# Altium schematic sheet ETH.SchDoc
size C; SheetNumber: 7; SheetTotal: 9
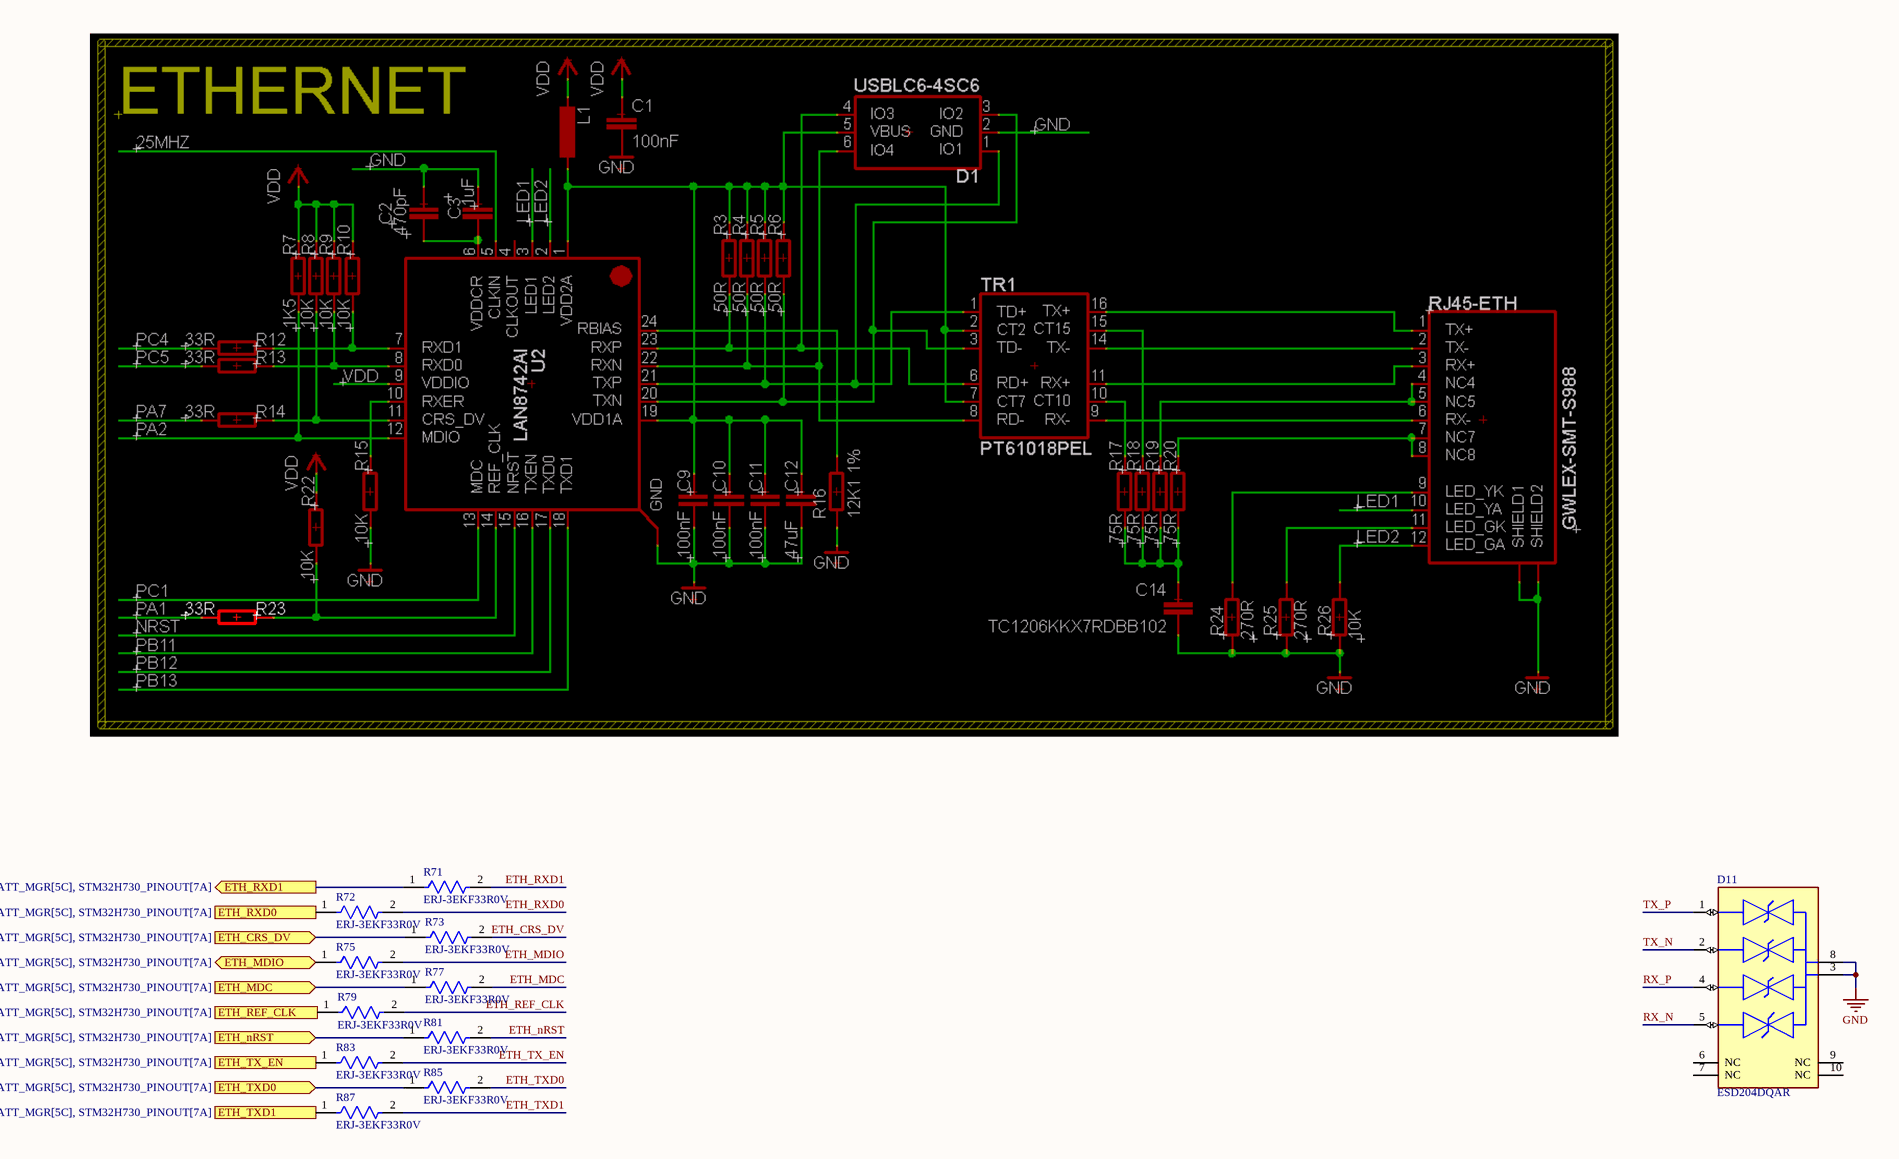
[diagram p0: ETH.SchDoc, top left]
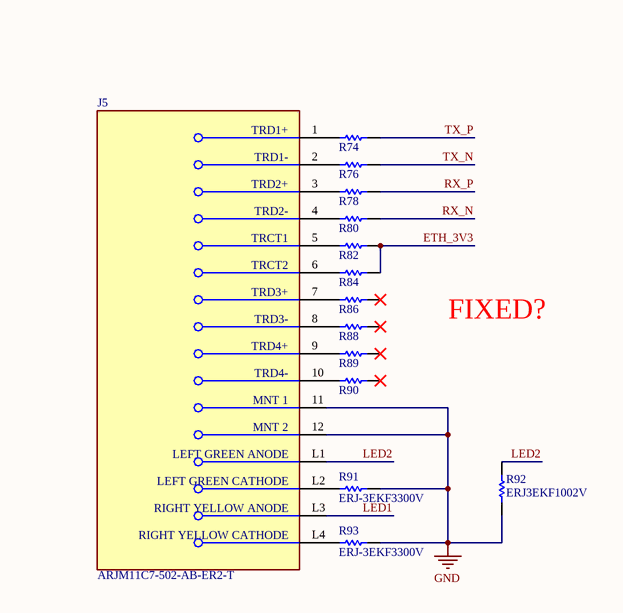
[diagram p1: ETH.SchDoc, top right]
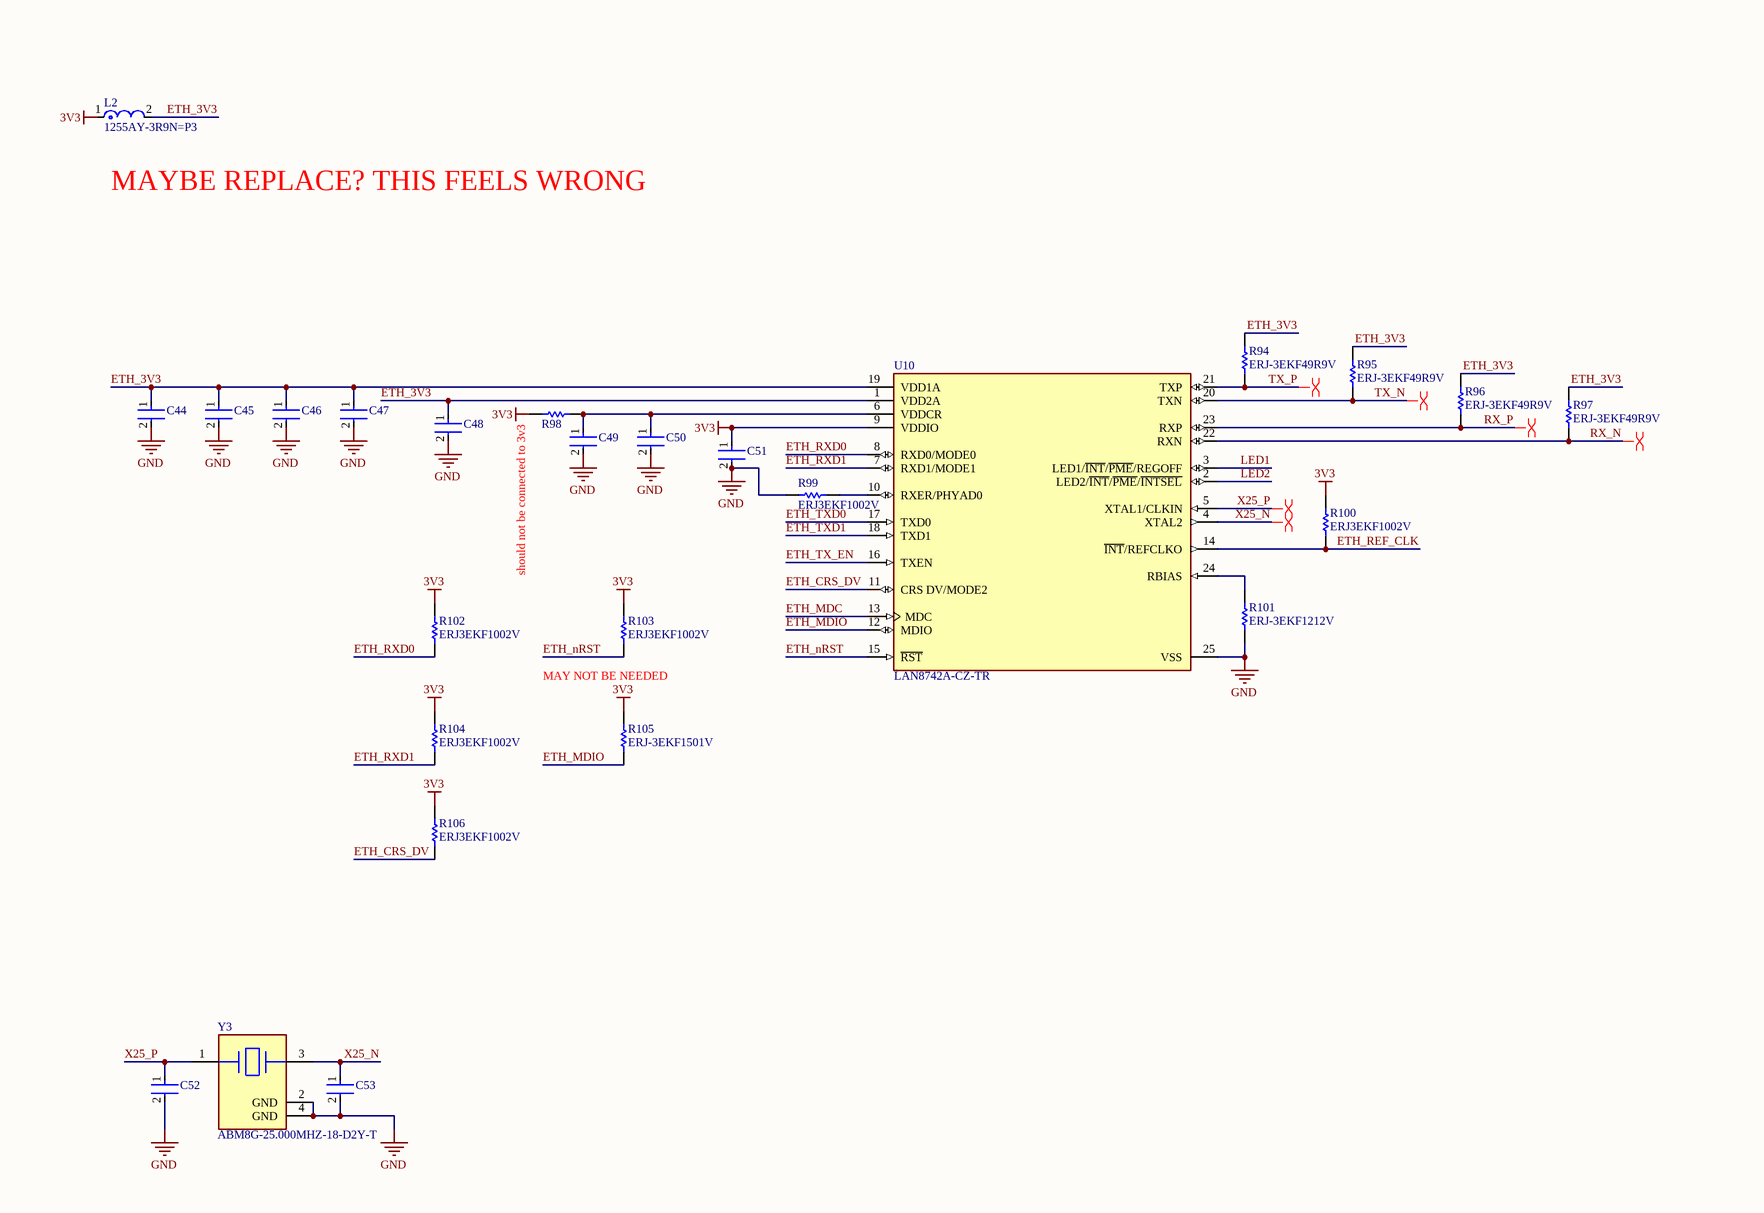
[diagram p2: ETH.SchDoc, bottom left]

## Parts
C44  DNO - C0805C476M9PACTU  [FP-C0805C476M9PACTU-MFG]  (value not drawn)
C45  100n  [FP-0402-L_1_0_0_05-W_0_5-IPC_A]  (value not drawn)
C46  100n  [FP-0402-L_1_0_0_05-W_0_5-IPC_A]  (value not drawn)
C47  100n  [FP-0402-L_1_0_0_05-W_0_5-IPC_A]  (value not drawn)
C48  100n  [FP-0402-L_1_0_0_05-W_0_5-IPC_A]  (value not drawn)
C49  1u  [FP-0402-L_1_0_0_05-W_0_5-IPC_A]  (value not drawn)
C50  470p  [FP-0402-L_1_0_0_05-W_0_5-IPC_A]  (value not drawn)
C51  100n  [FP-0402-L_1_0_0_05-W_0_5-IPC_A]  (value not drawn)
C52  C0603C300J5GACTU  [FP-C0603C-CF-MFG]  (value not drawn)
C53  C0603C300J5GACTU  [FP-C0603C-CF-MFG]  (value not drawn)
D11  ESD204DQAR  [FP-DQA0010A-MFG]
J5  ARJM11C7-502-AB-ER2-T  [FP-ARJM11C7-502-AB-ER2-T-MFG]
L2  1255AY-3R9N=P3  [FP-DG6045C-MFG]
R71  ERJ-3EKF33R0V  [FP-ERJ3EK-MFG]
R72  ERJ-3EKF33R0V  [FP-ERJ3EK-MFG]
R73  ERJ-3EKF33R0V  [FP-ERJ3EK-MFG]
R74  0402 JUMPER 0 OHM  [RESC1005X40X25NL05T05]  (value not drawn)
R75  ERJ-3EKF33R0V  [FP-ERJ3EK-MFG]
R76  0402 JUMPER 0 OHM  [RESC1005X40X25NL05T05]  (value not drawn)
R77  ERJ-3EKF33R0V  [FP-ERJ3EK-MFG]
R78  0402 JUMPER 0 OHM  [RESC1005X40X25NL05T05]  (value not drawn)
R79  ERJ-3EKF33R0V  [FP-ERJ3EK-MFG]
R80  0402 JUMPER 0 OHM  [RESC1005X40X25NL05T05]  (value not drawn)
R81  ERJ-3EKF33R0V  [FP-ERJ3EK-MFG]
R82  0402 JUMPER 0 OHM  [RESC1005X40X25NL05T05]  (value not drawn)
R83  ERJ-3EKF33R0V  [FP-ERJ3EK-MFG]
R84  0402 JUMPER 0 OHM  [RESC1005X40X25NL05T05]  (value not drawn)
R85  ERJ-3EKF33R0V  [FP-ERJ3EK-MFG]
R86  0402 JUMPER 0 OHM  [RESC1005X40X25NL05T05]  (value not drawn)
R87  ERJ-3EKF33R0V  [FP-ERJ3EK-MFG]
R88  0402 JUMPER 0 OHM  [RESC1005X40X25NL05T05]  (value not drawn)
R89  0402 JUMPER 0 OHM  [RESC1005X40X25NL05T05]  (value not drawn)
R90  0402 JUMPER 0 OHM  [RESC1005X40X25NL05T05]  (value not drawn)
R91  ERJ-3EKF3300V  [RESC1608X55X30LL15T15]
R92  ERJ3EKF1002V  [RESC1609X55X30LL15T15]
R93  ERJ-3EKF3300V  [RESC1608X55X30LL15T15]
R94  ERJ-3EKF49R9V  [RESC1608X55X30ML15T15]
R95  ERJ-3EKF49R9V  [RESC1608X55X30ML15T15]
R96  ERJ-3EKF49R9V  [RESC1608X55X30ML15T15]
R97  ERJ-3EKF49R9V  [RESC1608X55X30ML15T15]
R98  0402 JUMPER 0 OHM  [RESC1005X40X25NL05T05]  (value not drawn)
R99  ERJ3EKF1002V  [RESC1609X55X30LL15T15]
R100  ERJ3EKF1002V  [RESC1609X55X30LL15T15]
R101  ERJ-3EKF1212V  [RESC1608X55X30ML15T15]
R102  ERJ3EKF1002V  [RESC1609X55X30LL15T15]
R103  ERJ3EKF1002V  [RESC1609X55X30LL15T15]
R104  ERJ3EKF1002V  [RESC1609X55X30LL15T15]
R105  ERJ-3EKF1501V  [RESC1608X55X30ML15T15]
R106  ERJ3EKF1002V  [RESC1609X55X30LL15T15]
U10  LAN8742A-CZ-TR  [FP-C04-143B-S4QFN-MFG]
Y3  ABM8G-25.000MHZ-18-D2Y-T  [FP-ABM8G-MFG]

## Ports
ETH_CRS_DV (in, see BRZ_BATT_MGR[5C], STM32H730_PINOUT[7A]), ETH_MDC (in, see BRZ_BATT_MGR[5C], STM32H730_PINOUT[7A]), ETH_MDIO (bidir, see BRZ_BATT_MGR[5C], STM32H730_PINOUT[7A]), ETH_nRST (in, see BRZ_BATT_MGR[5C], STM32H730_PINOUT[7A]), ETH_REF_CLK (in, see BRZ_BATT_MGR[5C], STM32H730_PINOUT[7A]), ETH_RXD0 (out, see BRZ_BATT_MGR[5C], STM32H730_PINOUT[7A]), ETH_RXD1 (out, see BRZ_BATT_MGR[5C], STM32H730_PINOUT[7A]), ETH_TX_EN (in, see BRZ_BATT_MGR[5C], STM32H730_PINOUT[7A]), ETH_TXD0 (in, see BRZ_BATT_MGR[5C], STM32H730_PINOUT[7A]), ETH_TXD1 (in, see BRZ_BATT_MGR[5C], STM32H730_PINOUT[7A])

## Nets
3V3: C51.1 L2.1 R98.1 R100.2 R102.2 R103.2 R104.2 R105.2 R106.2 U10.9(VDDIO)
GND: C44.2 C45.2 C46.2 C47.2 C48.2 C49.2 C50.2 C51.2 C52.2 C53.2 D11.3(GND) D11.8(GND) J5.11(MNT_1) J5.12(MNT_2) R91.2 R92.1 R93.2 R99.1 R101.1 U10.25(VSS) Y3.2(GND) Y3.4(GND)
ETH_3V3: C44.1 C45.1 C46.1 C47.1 C48.1 L2.2 R82.2 R84.2 R94.2 R95.2 R96.2 R97.2 U10.1(VDD2A) U10.19(VDD1A)
ETH_CRS_DV: R73.2 R106.1 U10.11(CRS_DV/MODE2)
ETH_CRS_DV: R73.1 ; port ETH_CRS_DV  [a separate net that carries the same name]
ETH_MDC: R77.2 U10.13(MDC)
ETH_MDC: R77.1 ; port ETH_MDC  [a separate net that carries the same name]
ETH_MDIO: R75.2 R105.1 U10.12(MDIO)
ETH_MDIO: R75.1 ; port ETH_MDIO  [a separate net that carries the same name]
ETH_nRST: R81.2 R103.1 U10.15(~{RST})
ETH_nRST: R81.1 ; port ETH_nRST  [a separate net that carries the same name]
ETH_REF_CLK: R79.2 R100.1 U10.14(~{INT}/REFCLKO)
ETH_REF_CLK: R79.1 ; port ETH_REF_CLK  [a separate net that carries the same name]
ETH_RXD0: R72.2 R102.1 U10.8(RXD0/MODE0)
ETH_RXD0: R72.1 ; port ETH_RXD0  [a separate net that carries the same name]
ETH_RXD1: R71.2 R104.1 U10.7(RXD1/MODE1)
ETH_RXD1: R71.1 ; port ETH_RXD1  [a separate net that carries the same name]
ETH_TX_EN: R83.2 U10.16(TXEN)
ETH_TX_EN: R83.1 ; port ETH_TX_EN  [a separate net that carries the same name]
ETH_TXD0: R85.2 U10.17(TXD0)
ETH_TXD0: R85.1 ; port ETH_TXD0  [a separate net that carries the same name]
ETH_TXD1: R87.2 U10.18(TXD1)
ETH_TXD1: R87.1 ; port ETH_TXD1  [a separate net that carries the same name]
LED1: J5.L3(RIGHT_YELLOW_ANODE) U10.3(LED1/~{INT}/~{PME}/REGOFF)
LED2: J5.L1(LEFT_GREEN_ANODE) R92.2 U10.2(LED2/~{INT}/~{PME}/~{INTSEL})
RX_N: D11.5(IO4) R80.2 R97.1 U10.22(RXN)
RX_P: D11.4(IO3) R78.2 R96.1 U10.23(RXP)
TX_N: D11.2(IO2) R76.2 R95.1 U10.20(TXN)
TX_P: D11.1(IO1) R74.2 R94.1 U10.21(TXP)
X25_N: C53.1 U10.4(XTAL2) Y3.3
X25_P: C52.1 U10.5(XTAL1/CLKIN) Y3.1
NetC49_1: C49.1 C50.1 R98.2 U10.6(VDDCR)
NetJ5_1: J5.1(TRD1+) R74.1
NetJ5_2: J5.2(TRD1-) R76.1
NetJ5_3: J5.3(TRD2+) R78.1
NetJ5_4: J5.4(TRD2-) R80.1
NetJ5_5: J5.5(TRCT1) R82.1
NetJ5_6: J5.6(TRCT2) R84.1
NetJ5_7: J5.7(TRD3+) R86.1
NetJ5_8: J5.8(TRD3-) R88.1
NetJ5_9: J5.9(TRD4+) R89.1
NetJ5_10: J5.10(TRD4-) R90.1
NetJ5_L2: J5.L2(LEFT_GREEN_CATHODE) R91.1
NetJ5_L4: J5.L4(RIGHT_YELLOW_CATHODE) R93.1
NetR99_2: R99.2 U10.10(RXER/PHYAD0)
NetR101_2: R101.2 U10.24(RBIAS)

Not connected (* = marked no-connect by the designer): D11 6(NC) 7(NC) 9(NC) 10(NC); R86 2*; R88 2*; R89 2*; R90 2*

## Layout directives
differential pair: RX_N, RX_P, TX_N, TX_P, X25_N, X25_P

## Notes on the sheet
- FIXED?
- (near L2) MAYBE REPLACE? THIS FEELS WRONG
- (near R98) should not be connected to 3v3
- MAY NOT BE NEEDED

## Library data of the parts
C44 = CMP-2007-01008-2: CAP CER 47UF 6.3V X5R 0805; Dielectric Material: Ceramic; Dissipation Factor: 5%; Tolerance: 20%; Case Code (Imperial): 0805; Mount: PCB; Width: 1.2mm; Package Quantity: 3000; Radiation Hardening: No; Packaging: Tape and Reel; Termination: SMD/SMT; Series: C0805C; Voltage: 6.3V; Depth: 1.25mm; Dielectric: X5R; Case Code (Metric): 2012; Length: 2mm; Case/Package: 0805; REACH SVHC: No SVHC; Voltage Rating (DC): 6.3V; Capacitance: 47uF; RoHS Compliant: Yes; Height: 1.25mm; Construction: Flat; Number of Pins: 2; Voltage Rating: 6.3V; Max Operating Temperature: 85°C; Min Operating Temperature: -55°C
C45-C51 = CMP-001-00058-1: LARGE PADS, 0402 CAP, CHANGE COMMENT TO MATCH REAL P/N; Capacitor Type: Ceramic; Min Operating Temperature: -55°C; Mounting Technology: Surface Mount; Pins: 2; Case/Package: 0402; RoHS Compliant: Yes; Max Operating Temperature: 85°C
C52 C53 = CMP-1035-00914-3: CAP CER 30PF 50V 5% NP0 0603; Manufacturer: KEMET; Automotive Grade: Grade 1; Temperature Coefficient: 30ppm/°C; Material: Ceramic; Temperature Characteristic: C0G; Tolerance: 0.05; Manufacturer Part Number: C0603C300J5GACTU; ComponentLink2URL: https://api.kemet.com/component-edge/download/datasheet/C0603C100J5GACAUTO.pdf; Automotive: Yes; Device Class L2: Capacitors; Device Class L1: Passive Components; Device Class L3: Ceramic Capacitors; RoHS: TRUE; Octopart: https://octopart.com/c0603c300j5gactu-kemet-199455; Lead Free: Yes; Value: 30 pF; Temperature Range High: +125°C; Category: Cap; Temperature: -55°C to +125°C; Package: C0603C-CF; Capacitance: 30 pF; Digikey Description: CAP CER 30PF 50V 5% NP0 0603; Height: 0.87mm; ComponentLink2Description: Datasheet; Temperature Range Low: -55°C; Mouser Description: Multilayer Ceramic Capacitors MLCC - SMD/SMT 50volts 30pF C0G 5%; Voltage Rating: 50 V
D11 = CMP-04989-000002-1: 4-CHANNEL LOW-CAPACITANCE SURGE; Manufacturer: Texas Instruments; Value: 0.55pF; Reverse Standoff Voltage: 3.6V; Standoff Height: 0mm; Breakdown Voltage: 5.5V; Peak Pulse Current: 5.5A; Clamping Voltage: 11.5V; Direction: Bidirectional; Peak Pulse Power: 50W; Number Of Channels: 4; Ambient Temperature Range High: +125°C; ComponentLink2Description: Datasheet; Height: 0.55mm; Lead Free: Yes; Device Class L3: unset; Temperature Range High: +125°C; Temperature Range Low: -40°C; Package: DQA0010A; Temperature: -40°C to +125°C; Capacitance: 0.55pF; RoHS: TRUE; Mouser Description: 4-Channel Low-Capacitance Surge and ESD Protection Diode 10-USON -40 to 125; Category: Diode; Device Class L1: Circuit Protection; Octopart: https://octopart.com/esd204dqar-texas+instruments-89917476; Device Class L2: TVS Diodes; Ambient Temperature Range Low: -40°C; Manufacturer Part Number: ESD204DQAR; ComponentLink2URL: http://www.ti.com/lit/ds/symlink/esd204.pdf; Automotive: No; Digikey Description: 4-CHANNEL LOW-CAPACITANCE SURGE
J5 = CMP-27893-000001-1: RJ45 JACK W/MAG 1X1 1000BASE-T; Manufacturer: Abracon; Conn Gender: Female; Is Female: yes; Shielding: true; Pitch: 1.27mm; Number Of Contacts: 10; Conn Orientation: Right Angle; RoHS: TRUE; Digikey Description: RJ45 JACK W/MAG 1X1 1000BASE-T; Temperature Range Low: -40°C; ComponentLink2Description: Datasheet; Category: Conn; Temperature Range High: +85°C; Package: 0; Device Class L1: Connectors; Manufacturer Part Number: ARJM11C7-502-AB-ER2-T; ComponentLink2URL: https://abracon.com/Magnetics/ARJM11.pdf; Automotive: No; Contact Material: Gold; Height: 15.8mm; Lead Free: Yes; Temperature: -40°C to +85°C; Device Class L2: Modular / Ethernet Connectors; Device Class L3: unset; Octopart: https://octopart.com/arjm11c7-502-ab-er2-t-abracon-86945316
L2 = CMP-06042-002684-1: Shielded Wirewound Inductor 3.9uH 30% 4200mA 0.0264Ω SMD; Saturation Current: 4.7A; Test Frequency: 100kHz; Core Material: Ferrite; Current Rating: 4.2A; DC Resistance (DCR): 26.4mR; Inductance: 3.9uH; Resistor Type: Wirewound; Width: 0.248inch; Mount: Surface Mount; Tolerance: 30%; Packaging: Tape and Reel; Max Operating Temperature: 85°C; Shielding: Shielded; Length: 0.248inch; Min Operating Temperature: -40°C; Height - Seated (Max): 0.177inch; Case/Package: Nonstandard
R71-R73 R75 R77 R79 R81 R83 R85 R87 = CMP-2000-00443-2: RES SMD 33 OHM 1% 1/10W 0603; Voltage Rating (DC): 75V; Power Rating: 100mW; Resistance: 33R; Temperature Coefficient: 100ppm/°C; Min Operating Temperature: -55°C; Packaging: Tape and Reel; Mount: Surface Mount; Lead Free: Lead Free; Voltage Rating: 75V; Features: Automotive AEC-Q200; Height: 0.022inch; Width: 0.031inch; Number of Pins: 2; Package Quantity: 1; Case Code (Metric): 1608; Max Power Dissipation: 100mW; Case Code (Imperial): 0603; Termination: SMD/SMT; Resistance Tolerance: 1%; Max Operating Temperature: 155°C; Tolerance: 1%; Length: 1.6mm; Case/Package: 0603; Military Standard: Not; RoHS Compliant: Yes; Series: ERJ; Size Code: 0603; Construction: Rectangular; Number of Terminations: 2; Radiation Hardening: No; Resistor Type: Thick Film; Contact Plating: Tin; Depth: 0.8mm; REACH SVHC: No SVHC
R74 R76 R78 R80 R82 R84 R86 R88-R90 R98 = CMP-009-00206-2: READ THE NAME
R91 R93 = CMP-2000-00435-2: Chip Resistor, 330 Ohm, +/- 1%, 0.1 W, -55 to 155 degC, 0603 (1608 Metric), RoHS, Tape and Reel; Gender: Male; Mating Cycles: 10000; Current Rating: 500 mA; Voltage Rating: 10 V; REACH SVHC: No SVHC; PackageDescription: 2-Pin Surface Mount Device, Body 1.6 x 0.85 mm; Contact Finish: Gold; Pins: 8; ComponentLink1Description: Manufacturer URL; Packaging: Tape and Reel; Max Operating Temperature: 85 degC; Contact Material: Copper; Height: 1.45 mm; Width: 1.45 mm; DatasheetVersion: Apr-15; Package Quantity: 1500; Contact Plating: Gold; PackageReference: 0603; Mount: Surface Mount; Lead Pitch: 1.1 mm; Min Operating Temperature: -25 degC; ComponentLink1URL: http://www.panasonic.com/; ComponentLink2URL: http://industrial.panasonic.com/cdbs/www-data/pdf/RDA0000/AOA0000C86.pdf; Length: 13.7 mm; ComponentLink2Description: Datasheet; RoHSCompliant: true
R92 R99 R100 R102-R104 R106 = CMP-1012-00623-3: Chip Resistor, 10 KOhm, +/- 1%, 0.1 W, -55 to 155 degC, 0603 (1608 Metric), RoHS, Tape and Reel; Manufacturer: Panasonic; Voltage Rating: 75V; Case\/Package: 0603; Power Rating: 100mW; Resistance: 10KOhm; Temperature Coefficient: 100ppm\/degreesC; Number of Pins: 2; Package Reference: 603; Depth: 0.8mm; Mount: SurfaceMount; Package Description: 2-Pin Surface Mount Device, Body 1.6 x 0.85 mm; Datasheet Version: 02/2017; Length: 1.6mm; Lead Free: LeadFree; Height: 0.45mm; Number of Terminations: 2; Max Power Dissipation: 100mW; Min Operating Temperature: -55degC; Datasheet URL: https://industrial.panasonic.com/cdbs/www-data/pdf/RDA0000/AOA0000C304.pdf; Termination: SMD/SMT; Case Code (Metric): 1608; Case Code (Imperial): 0603; Tolerance: 1%; Max Operating Temperature: 155degC; RoHSCompliant: true; Voltage Rating (DC): 75V; Radiation Hardening: No; Packaging: TapeandReel; Composition: ThickFilm; Mounting Technology: SurfaceMount; Manufacturer URL: http://www.panasonic.com/; Width: 0.031inch; REACH SVHC: NoSVHC; Contact Plating: Tin; Military Standard: Not; Package Quantity: 1
R94-R97 = CMP-2000-00538-1: Manufacturer: Panasonic; Part Number: ERJ-3EKF49R9V
R101 = CMP-2000-00220-1: Manufacturer: Panasonic; Part Number: ERJ-3EKF1212V
R105 = CMP-1012-00528-2: Manufacturer: Panasonic; Part Number: ERJ-3EKF1501V
U10 = CMP-06281-000006-2: IC TRANSCEIVER 1/1 24SQFN; Manufacturer: Microchip; Nominal Supply Current: 6.5-59mA; Max Supply Voltage: 3.6V; Number Of Channels: 1; Data Rate: 100Mbits/s; Interface: Ethernet,Other; Min Supply Voltage: 1.14V; Standoff Height: 0mm; Simplex Duplex: Full-Duplex; Height: 1mm; Ambient Temperature Range High: +70°C; Category: IC; Mouser Description: Small Footprint RMII 10/100 Ethernet Transceiver with flexPWR Technology; Manufacturer Part Number: LAN8742A-CZ-TR; Digikey Description: IC TRANSCEIVER 1/1 24SQFN; Octopart: https://octopart.com/lan8742a-cz-tr-microchip-29030587; Temperature: 0°C to +70°C; Ambient Temperature Range Low: 0°C; Temperature Range Low: 0°C; ComponentLink2Description: Datasheet; Automotive: No; RoHS: TRUE; Device Class L3: Ethernet Interface ICs; Device Class L1: Integrated Circuits (ICs); Device Class L2: Interface ICs; Lead Free: Yes; Ipc Land Pattern Name: QFN50P400X400X90-24; ComponentLink2URL: http://ww1.microchip.com/downloads/en/DeviceDoc/DS_LAN8742_00001989A.pdf; Temperature Range High: +70°C; Package: C04-143B-S4QFN
Y3 = CMP-2000-05733-3: Crystal 25MHz ±20ppm (Tol) ±30ppm (Stability) 18pF FUND 60Ω 4-Pin SMD T/R; Series Resistance: 60R; Length: 3.2mm; Depth: 2.5mm; Packaging: Tape and Reel; Min Operating Temperature: -40°C; Operating Frequency: 25 MHz; Lead Free: Lead Free; Number of Pins: 4; Frequency Tolerance: 20ppm; Radiation Hardening: No; Max Operating Temperature: 85°C; Termination: SMD/SMT; Frequency Stability: 30ppm; Frequency: 25MHz; Series: ABM8G; Mount: Surface Mount; Package Quantity: 1000; Height: 0.039inch; Width: 0.098inch; Case/Package: CSMD; ESR (Equivalent Series Resistance): 60R; Load Capacitance: 18pF; Tolerance: 20ppm